# EAGLE design energy_monitor_v1 (EAGLE 9.6.2)
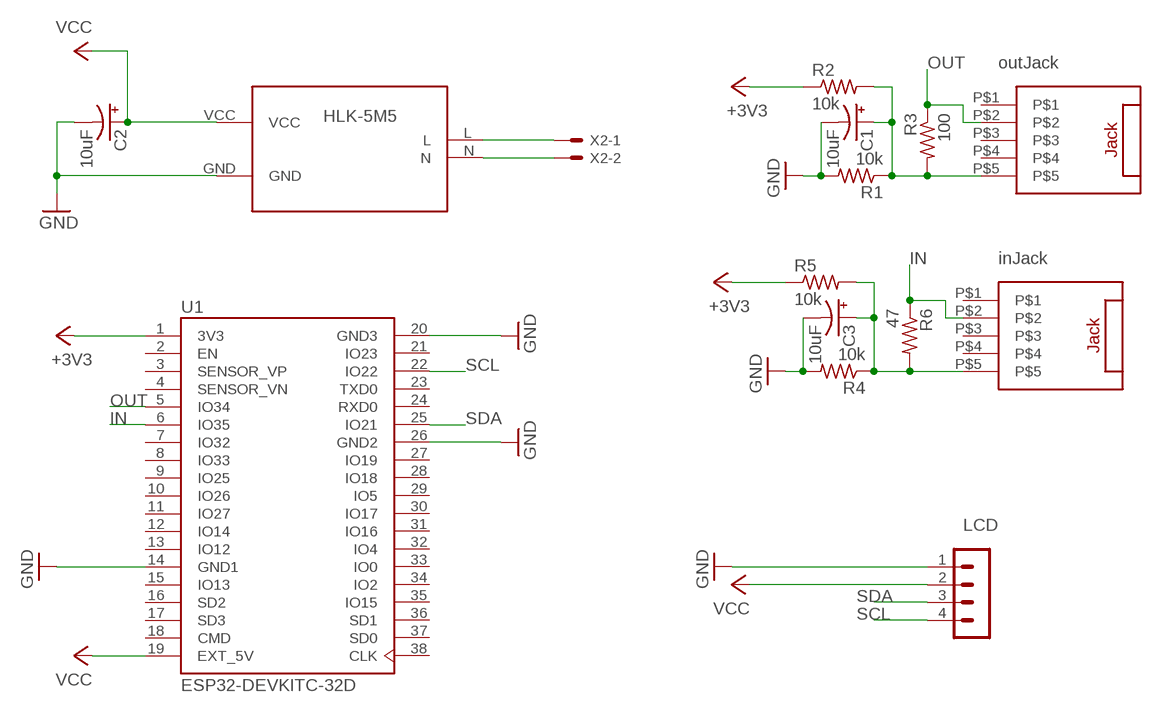
[diagram p0: schematic, sheet 1]

## Parts
C1  10uF  CPOL-USB45181A  [B45181A]
C2  10uF  CPOL-USB45181A  [B45181A]
C3  10uF  CPOL-USB45181A  [B45181A]
HLK-5M5  HLK-5M05  [CONV_HLK-5M05]
R1  10k  R-US_0204/7  [0204/7]
R2  10k  R-US_0204/7  [0204/7]
R3  100  R-US_0204/7  [0204/7]
R4  10k  R-US_0204/7  [0204/7]
R5  10k  R-US_0204/7  [0204/7]
R6  47  R-US_0204/7  [0204/7]
SV3  MA04-1  [MA04-1]
U1  ESP32-DEVKITC-32D  [MODULE_ESP32-DEVKITC-32D]
U$1  JACK_5PINS  [JACK_5PINS]
U$2  JACK_5PINS  [JACK_5PINS]
X2  JST-XH-02-PIN-LONG-PAD  [JST-XH-02-PACKAGE-LONG-PAD]

## Nets
+3V3: R2.1 R5.1 U1.1(3V3)
GND: C1.- C2.- C3.- HLK-5M5.GND R1.2 R4.2 SV3.1 U1.14(GND1) U1.20(GND3) U1.26(GND2)
IN: R6.1 U1.6(IO35) U$2.P$2
N$1: HLK-5M5.N X2.2
N$2: HLK-5M5.L X2.1
N$3: C1.+ R1.1 R2.2 R3.2 U$1.P$5
N$5: C3.+ R4.1 R5.2 R6.2 U$2.P$5
OUT: R3.1 U1.5(IO34) U$1.P$2
SCL: SV3.4 U1.22(IO22)
SDA: SV3.3 U1.25(IO21)
VCC: C2.+ HLK-5M5.VCC SV3.2 U1.19(EXT_5V)
Unconnected: U1.2(EN) U1.3(SENSOR_VP) U1.4(SENSOR_VN) U1.7(IO32) U1.8(IO33) U1.9(IO25) U1.10(IO26) U1.11(IO27) U1.12(IO14) U1.13(IO12) U1.15(IO13) U1.16(SD2) U1.17(SD3) U1.18(CMD) U1.21(IO23) U1.23(TXD0) U1.24(RXD0) U1.27(IO19) U1.28(IO18) U1.29(IO5) U1.30(IO17) U1.31(IO16) U1.32(IO4) U1.33(IO0) U1.34(IO2) U1.35(IO15) U1.36(SD1) U1.37(SD0) U1.38(CLK) U$1.P$1 U$1.P$3 U$1.P$4 U$2.P$1 U$2.P$3 U$2.P$4

## Notes on the sheet
- outJack
- HLK-5M5
- inJack
- LCD

## Library data of the parts
C1-C3 = adafruit:CPOL-US: POLARIZED CAPACITOR, American symbol
HLK-5M5 = HLK-PM03:HLK-5M05
R1-R6 = adafruit:R-US_: RESISTOR, American symbol
SV3 = con-lstb:MA04-1: PIN HEADER; OC_FARNELL: unknown; OC_NEWARK: unknown
U1 = ESP32-DEVKITC-32D:ESP32-DEVKITC-32D: Eval Board For Esp-Wroom-32 Check availability <https://pricing.snapeda.com/parts/ESP32-DEVKITC-32D/Espressif%20Systems/view-part?ref=eda>; AVAILABILITY: In Stock; DESCRIPTION: WiFi Development Tools (802.11) ESP32 General Development Kit, ESP32-WROOM-32D on the board; MF: Espressif Systems; MP: ESP32-DEVKITC-32D; PACKAGE: None; PRICE: None; PURCHASE-URL: https://pricing.snapeda.com/search/part/ESP32-DEVKITC-32D/?ref=eda
U$1 U$2 = jack:JACK_5PINS
X2 = jstConnector-2.5:JST-XH-02-PIN: JST XH Connector 2 Pin Wire to board connector. Pitch: 2,54 mm, (0.100") Number of pins: 2 Created by Rembrandt Electronics www.rembrandtelectronics.com

## Board
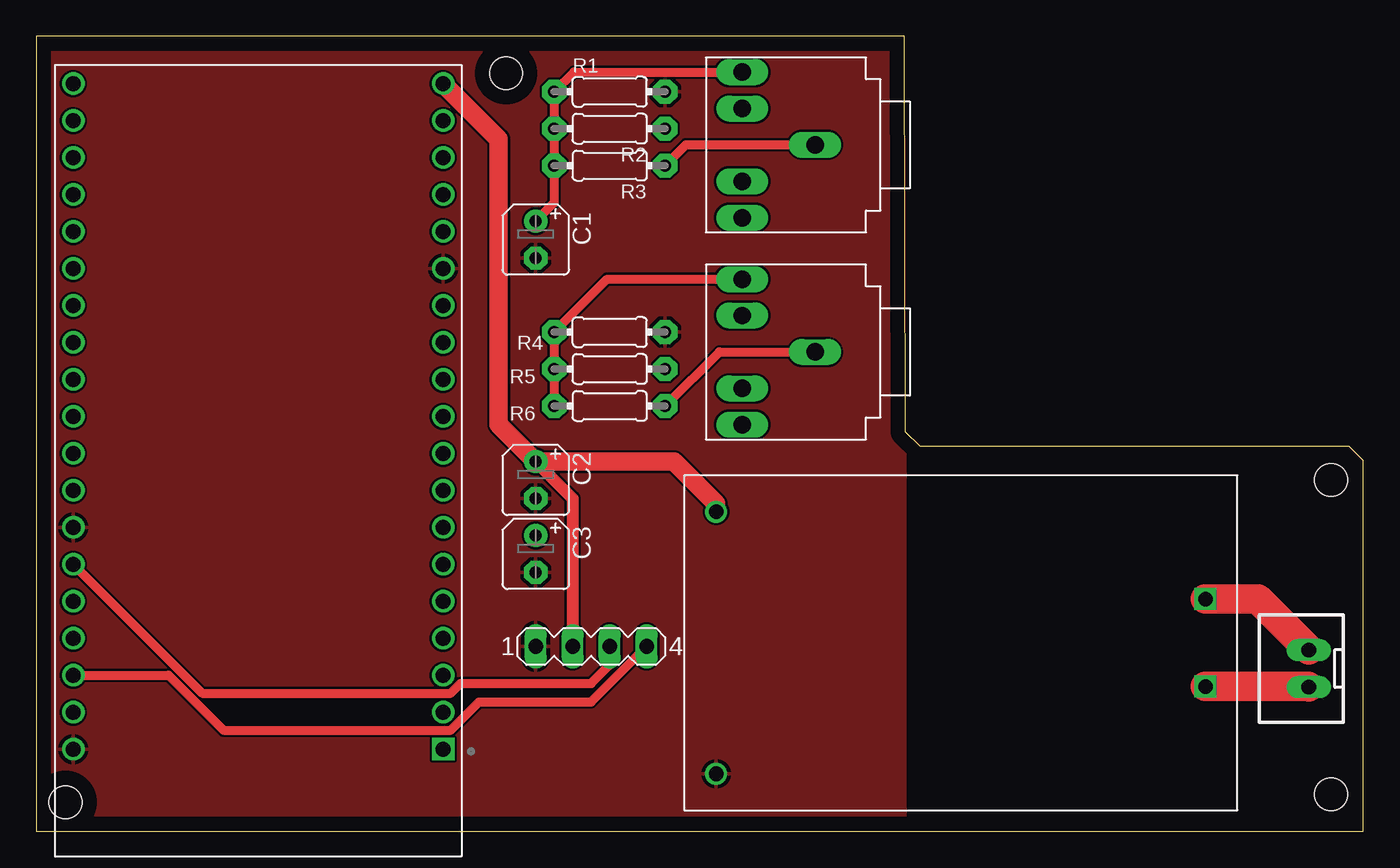
[diagram p1: board, top side]
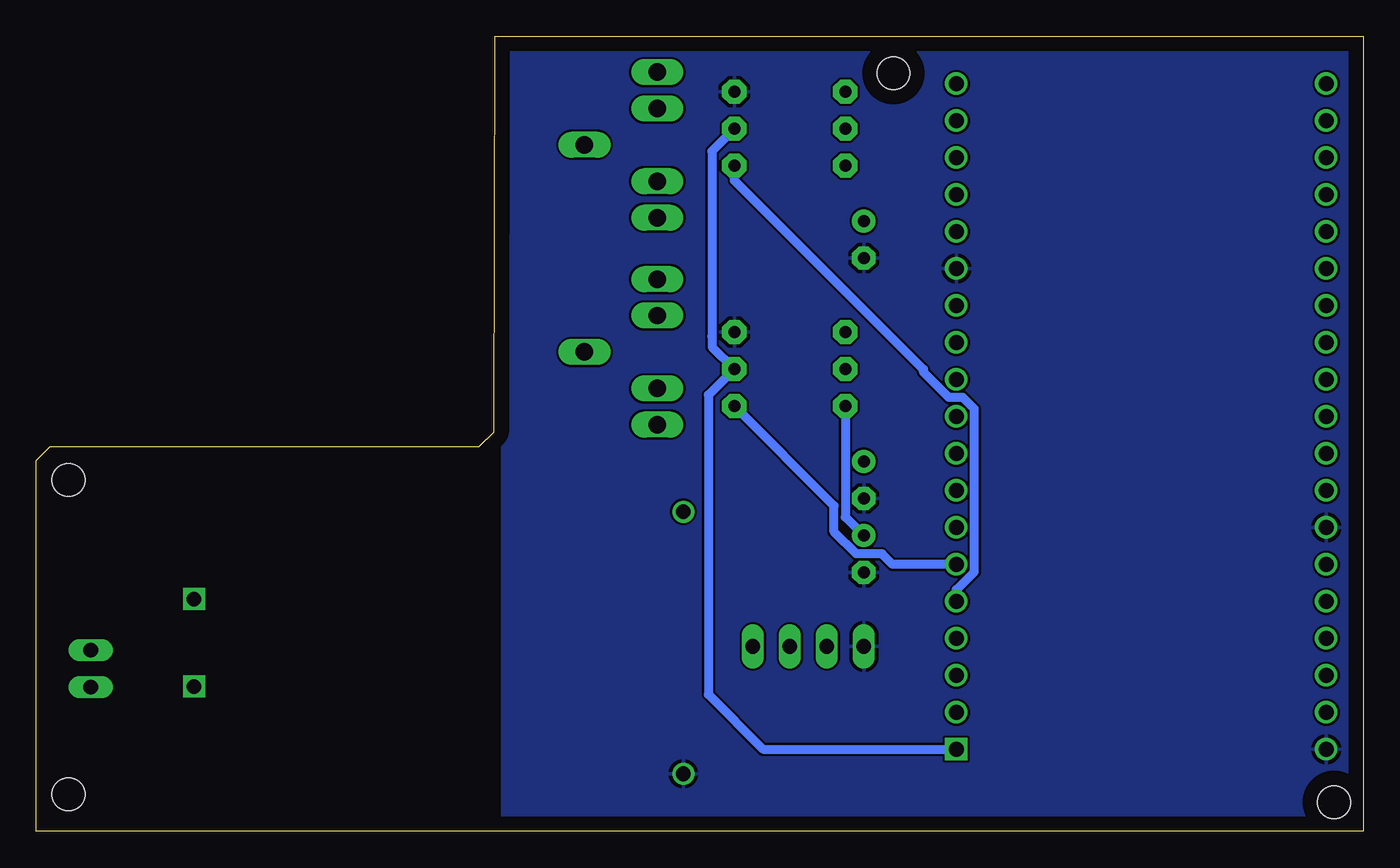
[diagram p2: board, bottom side, seen from below]

Size 91.11 x 54.6 mm. Coordinates in mm from the lower left corner, seen from the top.
Outline: 0,0 91.11,0 91.11,25.48 90.17,26.42 60.71,26.42 59.69,27.43 59.61,54.6 0,54.6 0,0
Copper layers (1*16): Top 0.035mm / dielectric 1.5mm / Bottom 0.035mm
Design rules "default": minimum track width 6mil, minimum drill 0.35mm, track to track 6mil, track to pad 6mil, pad to pad 6mil, via to via 6mil, smd to smd 6mil, copper to edge 40mil, drill to drill 6mil, minimum pad ring 10mil, minimum via ring 8mil, stop-mask expansion 4mil, vias tented up to drill 0mil, thermal gap 10mil
Holes 2.25 mm at 2,2 32.26,52.07 88.9,2.54 88.9,24.13

### Footprints (pad centres in the part's own frame; a part is rotated, then mirrored left to right if it is on the bottom)
B45181A = drill 0.813 pad 1.6: + -1.27,0 | drill 0.813 pad 1.6 octagon: - 1.27,0
CONV_HLK-5M05 = drill 1: GND 15.8,8.5; VCC 15.8,-9.5 | drill 1 square: L -17.8,2.5; N -17.8,-3.5
0204/7 = drill 0.813 pad 1.676 octagon: 1 -3.81,0; 2 3.81,0
MA04-1 = drill 1.016 long: 1 -3.81,0; 2 -1.27,0; 3 1.27,0; 4 3.81,0
MODULE_ESP32-DEVKITC-32D = drill 1.04 square: 1 -12.7,19.76 | drill 1.04: 2 -12.7,17.22; 3 -12.7,14.68; 4 -12.7,12.14; 5 -12.7,9.6; 6 -12.7,7.06; 7 -12.7,4.52; 8 -12.7,1.98; 9 -12.7,-0.56; 10 -12.7,-3.1; 11 -12.7,-5.64; 12 -12.7,-8.18; 13 -12.7,-10.72; 14 -12.7,-13.26; 15 -12.7,-15.8; 16 -12.7,-18.34; 17 -12.7,-20.88; 18 -12.7,-23.42; 19 -12.7,-25.96; 20 12.7,19.76; 21 12.7,17.22; 22 12.7,14.68; 23 12.7,12.14; 24 12.7,9.6; 25 12.7,7.06; 26 12.7,4.52; 27 12.7,1.98; 28 12.7,-0.56; 29 12.7,-3.1; 30 12.7,-5.64; 31 12.7,-8.18; 32 12.7,-10.72; 33 12.7,-13.26; 34 12.7,-15.8; 35 12.7,-18.34; 36 12.7,-20.88; 37 12.7,-23.42; 38 12.7,-25.96
JACK_5PINS = drill 1.2 long: P$1 2.5,1; P$2 7.5,6; P$3 2.5,3.5; P$4 2.5,8.5; P$5 2.5,11
JST-XH-02-PACKAGE-LONG-PAD = drill 1.016 long: 1 -1.27,0; 2 1.27,0

### Placement (x,y rotation side)
C1  34.29,40.64 270 top
C2  34.29,24.13 270 top
C3  34.29,19.05 270 top
HLK-5M5  62.48,12.45 180 top
R1  39.37,50.8 0 top
R2  39.37,48.26 180 top
R3  39.37,45.72 180 top
R4  39.37,34.29 0 top
R5  39.37,31.75 180 top
R6  39.37,29.21 180 top
SV3  38.1,12.7 0 top
U1  15.24,25.4 180 top
U$1  45.97,41.15 0 top
U$2  45.97,26.92 0 top
X2  87.38,11.18 90 top

### Tracks (layer width: path | path; a pad name or v marks a point on that pad's centre or on a via)
+3V3
  Bottom 0.61: R2.1 44.73,46.71 44.73,34.01 44.7,33.98 44.7,33.27 R5.1 44.96,29.97 44.96,9.4 41.2,5.64 U1.1
GND
  pour Top: 59.69,56.39 59.69,-3.3 -2.29,-3.3 -2.54,-3.05 -2.54,56.13 -2.29,56.39
  pour Bottom: 59.18,56.13 59.18,-3.56 -1.52,-3.56 -2.03,-3.05 -2.03,56.13
IN
  Top 0.61: R6.1 46.89,32.92 U$2.P$2
  Bottom 0.61: U1.6 32.31,18.34 33.03,19.06 34.81,19.06 36.32,20.57 36.32,22.35 R6.1
N$1
  Top 2.032: HLK-5M5.N 83.88,15.95 X2.2
N$2
  Top 2.032: HLK-5M5.L 87.34,9.95 X2.1
N$3
  Top 0.61: C1.+ 35.56,43.18 R3.2 R2.2 R1.1 36.91,52.15 U$1.P$5
N$5
  Top 0.61: R6.2 R5.2 R4.1 39.19,37.92 U$2.P$5
  Bottom 0.61: R6.2 35.56,21.59 C3.+
OUT
  Top 0.61: R3.1 44.61,47.15 U$1.P$2
  Bottom 0.61: U1.5 27.94,16.59 26.7,17.83 26.7,29.01 27.49,29.8 28.45,29.8 30.19,31.54 30.19,31.72 43.18,44.7 R3.1
SCL
  Top 0.61: U1.22 9.08,10.72 12.86,6.94 28.45,6.94 30.4,8.89 38.1,8.89 SV3.4
SDA
  Top 0.61: SV3.3 39.37,11.43 38.1,10.16 29.13,10.16 28.45,9.48 11.4,9.48 U1.25
VCC
  Top 0.813: SV3.2 36.83,22.86 C2.+
  Top 1.27: U1.19 31.75,47.55 31.75,27.94 C2.+ 43.8,25.4 46.68,22.52 HLK-5M5.VCC

### Text on the board
tTest: OUT | ESP32 | IN | JLCJLCJLCJLC | gnd | vcc | sda | scl | HLK-5M05
bTest: Lettore corrente v1 | Il garage del Bicchio